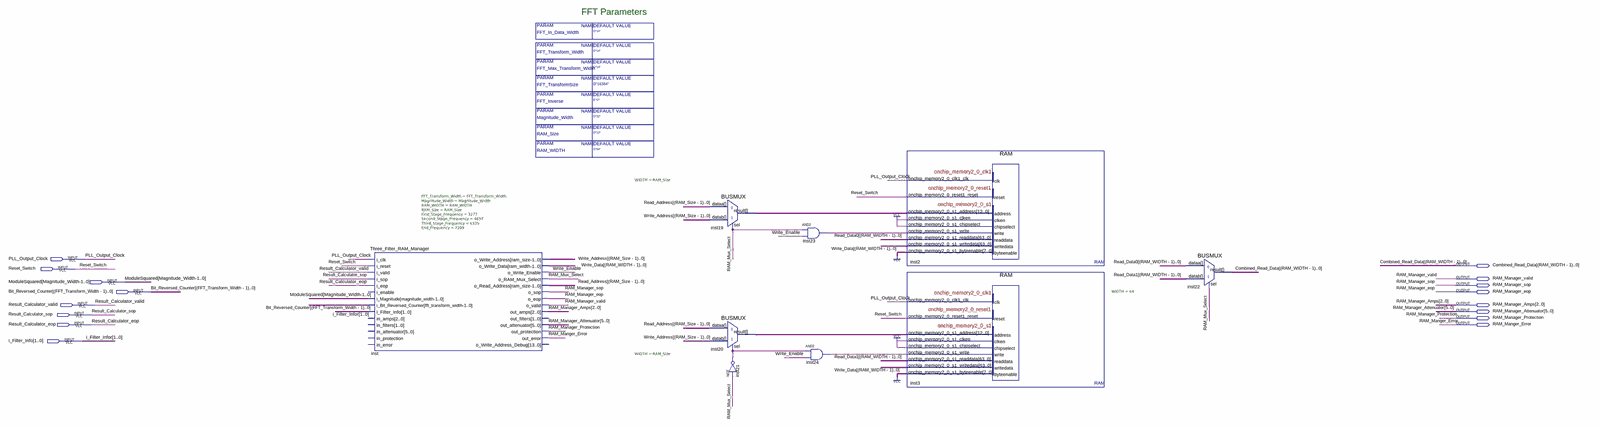
[diagram p0: schematic sheet, whole]
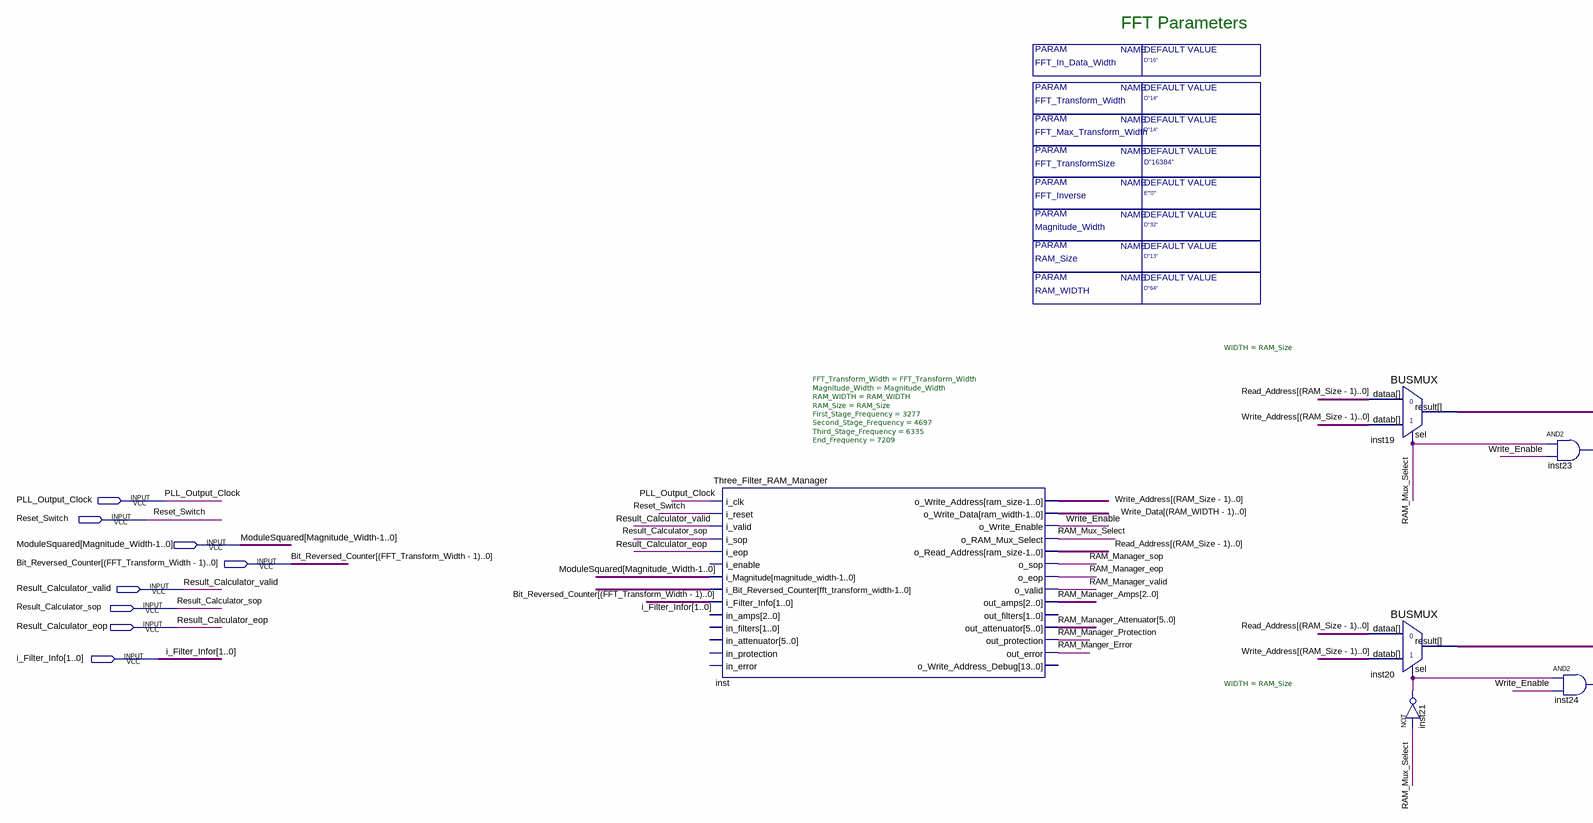
[diagram p1: schematic sheet, left part]
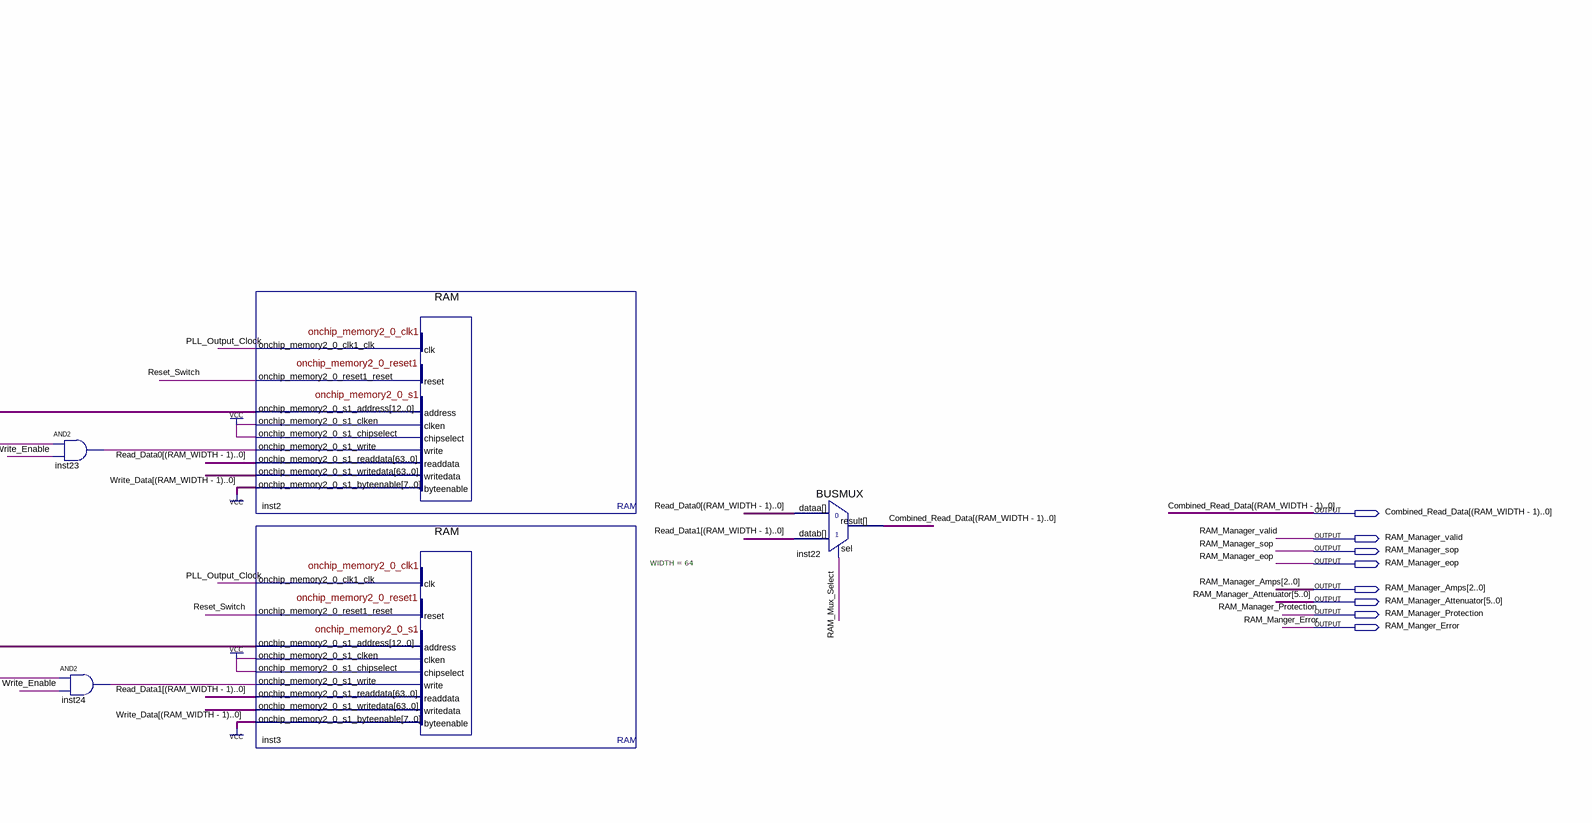
[diagram p2: schematic sheet, right part]
// Quartus schematic Three_Filter_RAM_Manager_Block.bdf as structural Verilog: 9 symbols, 16 pins
module Three_Filter_RAM_Manager_Block #(parameter FFT_Inverse = "E\"'0'\"", parameter FFT_In_Data_Width = "D\"16\"", parameter Magnitude_Width = "D\"32\"", parameter FFT_Transform_Width = "D\"14\"", parameter FFT_Max_Transform_Width = "D\"14\"", parameter FFT_TransformSize = "D\"16384\"", parameter RAM_WIDTH = "D\"64\"", parameter RAM_Size = "D\"13\"") (
  input  PLL_Output_Clock,
  input  Reset_Switch,
  input  \ModuleSquared[Magnitude_Width-1..0] ,
  input  \Bit_Reversed_Counter[(FFT_Transform_Width_-_1)..0] ,
  input  Result_Calculator_valid,
  input  Result_Calculator_sop,
  input  Result_Calculator_eop,
  input  [1:0] i_Filter_Info,
  output \Combined_Read_Data[(RAM_WIDTH_-_1)..0] ,
  output RAM_Manager_valid,
  output RAM_Manager_sop,
  output RAM_Manager_eop,
  output [2:0] RAM_Manager_Amps,
  output [5:0] RAM_Manager_Attenuator,
  output RAM_Manager_Protection,
  output RAM_Manger_Error
);

  wire inst21_out, inst23_out, inst24_out, RAM_Mux_Select, \Read_Address[(RAM_Size_-_1)..0] ,
       \Read_Data0[(RAM_WIDTH_-_1)..0] , \Read_Data1[(RAM_WIDTH_-_1)..0] ,
       \Write_Address[(RAM_Size_-_1)..0] , \Write_Data[(RAM_WIDTH_-_1)..0] , Write_Enable;
  wire [12:0] inst19_result, inst20_result;

  Three_Filter_RAM_Manager #(.FFT_Transform_Width(FFT_Transform_Width), .Magnitude_Width(Magnitude_Width), .RAM_WIDTH(RAM_WIDTH), .RAM_Size(RAM_Size), .First_Stage_Frequency(3277), .Second_Stage_Frequency(4697), .Third_Stage_Frequency(6335), .End_Frequency(7209)) inst (
    .i_clk(PLL_Output_Clock), .i_reset(Reset_Switch), .i_valid(Result_Calculator_valid),
    .i_sop(Result_Calculator_sop), .i_eop(Result_Calculator_eop),
    .i_Magnitude(\ModuleSquared[Magnitude_Width-1..0] ),
    .i_Bit_Reversed_Counter(\Bit_Reversed_Counter[(FFT_Transform_Width_-_1)..0] ),
    .i_Filter_Info(i_Filter_Info), .o_Write_Address(\Write_Address[(RAM_Size_-_1)..0] ),
    .o_Write_Data(\Write_Data[(RAM_WIDTH_-_1)..0] ), .o_Write_Enable(Write_Enable),
    .o_RAM_Mux_Select(RAM_Mux_Select), .o_Read_Address(\Read_Address[(RAM_Size_-_1)..0] ),
    .o_sop(RAM_Manager_sop), .o_eop(RAM_Manager_eop), .o_valid(RAM_Manager_valid),
    .out_amps(RAM_Manager_Amps), .out_attenuator(RAM_Manager_Attenuator),
    .out_protection(RAM_Manager_Protection), .out_error(RAM_Manger_Error));  // open: i_enable, in_amps, in_filters, in_attenuator, in_protection, in_error, out_filters, o_Write_Address_Debug
  BUSMUX #(.WIDTH(RAM_Size)) inst19 (
    .datab(\Write_Address[(RAM_Size_-_1)..0] ), .sel(RAM_Mux_Select),
    .dataa(\Read_Address[(RAM_Size_-_1)..0] ), .result(inst19_result));
  BUSMUX #(.WIDTH(RAM_Size)) inst20 (
    .datab(\Write_Address[(RAM_Size_-_1)..0] ), .sel(inst21_out), .dataa(\Read_Address[(RAM_Size_-_1)..0] ),
    .result(inst20_result));
  not inst21 (inst21_out, RAM_Mux_Select);
  and inst23 (inst23_out, RAM_Mux_Select, Write_Enable);
  and inst24 (inst24_out, inst21_out, Write_Enable);
  RAM inst2 (
    .onchip_memory2_0_clk1_clk(PLL_Output_Clock), .onchip_memory2_0_reset1_reset(Reset_Switch),
    .onchip_memory2_0_s1_address(inst19_result), .onchip_memory2_0_s1_clken(1'b1),
    .onchip_memory2_0_s1_chipselect(1'b1), .onchip_memory2_0_s1_write(inst23_out),
    .onchip_memory2_0_s1_writedata({64{\Write_Data[(RAM_WIDTH_-_1)..0] }}),
    .onchip_memory2_0_s1_byteenable({8{1'b1}}),
    .onchip_memory2_0_s1_readdata(\Read_Data0[(RAM_WIDTH_-_1)..0] ));
  RAM inst3 (
    .onchip_memory2_0_clk1_clk(PLL_Output_Clock), .onchip_memory2_0_reset1_reset(Reset_Switch),
    .onchip_memory2_0_s1_address(inst20_result), .onchip_memory2_0_s1_clken(1'b1),
    .onchip_memory2_0_s1_chipselect(1'b1), .onchip_memory2_0_s1_write(inst24_out),
    .onchip_memory2_0_s1_writedata({64{\Write_Data[(RAM_WIDTH_-_1)..0] }}),
    .onchip_memory2_0_s1_byteenable({8{1'b1}}),
    .onchip_memory2_0_s1_readdata(\Read_Data1[(RAM_WIDTH_-_1)..0] ));
  BUSMUX #(.WIDTH(64)) inst22 (
    .datab({64{\Read_Data1[(RAM_WIDTH_-_1)..0] }}), .sel(RAM_Mux_Select),
    .dataa({64{\Read_Data0[(RAM_WIDTH_-_1)..0] }}), .result(\Combined_Read_Data[(RAM_WIDTH_-_1)..0] ));

  // Other names for the same wires on the sheet: i_Filter_Infor[1:0] = i_Filter_Info

  // Notes on the sheet:
  //   FFT Parameters
endmodule
